# Altium project DM2080.PrjPcb (part 5 of 6)

## Sheet DM2080_USB.SchDoc: =project_title
size Tabloid; CompanyName: Luxonis Holding; DrawnBy: David Malovrh; Organization: Luxonis Holding; Address1: 1925 Harmony Park Drive; Address2: Westminster, CO; Address3: 80234; Address4: United States; DocumentNumber: D0001093; Revision: R1M1E1; SheetNumber: 9; SheetTotal: 9
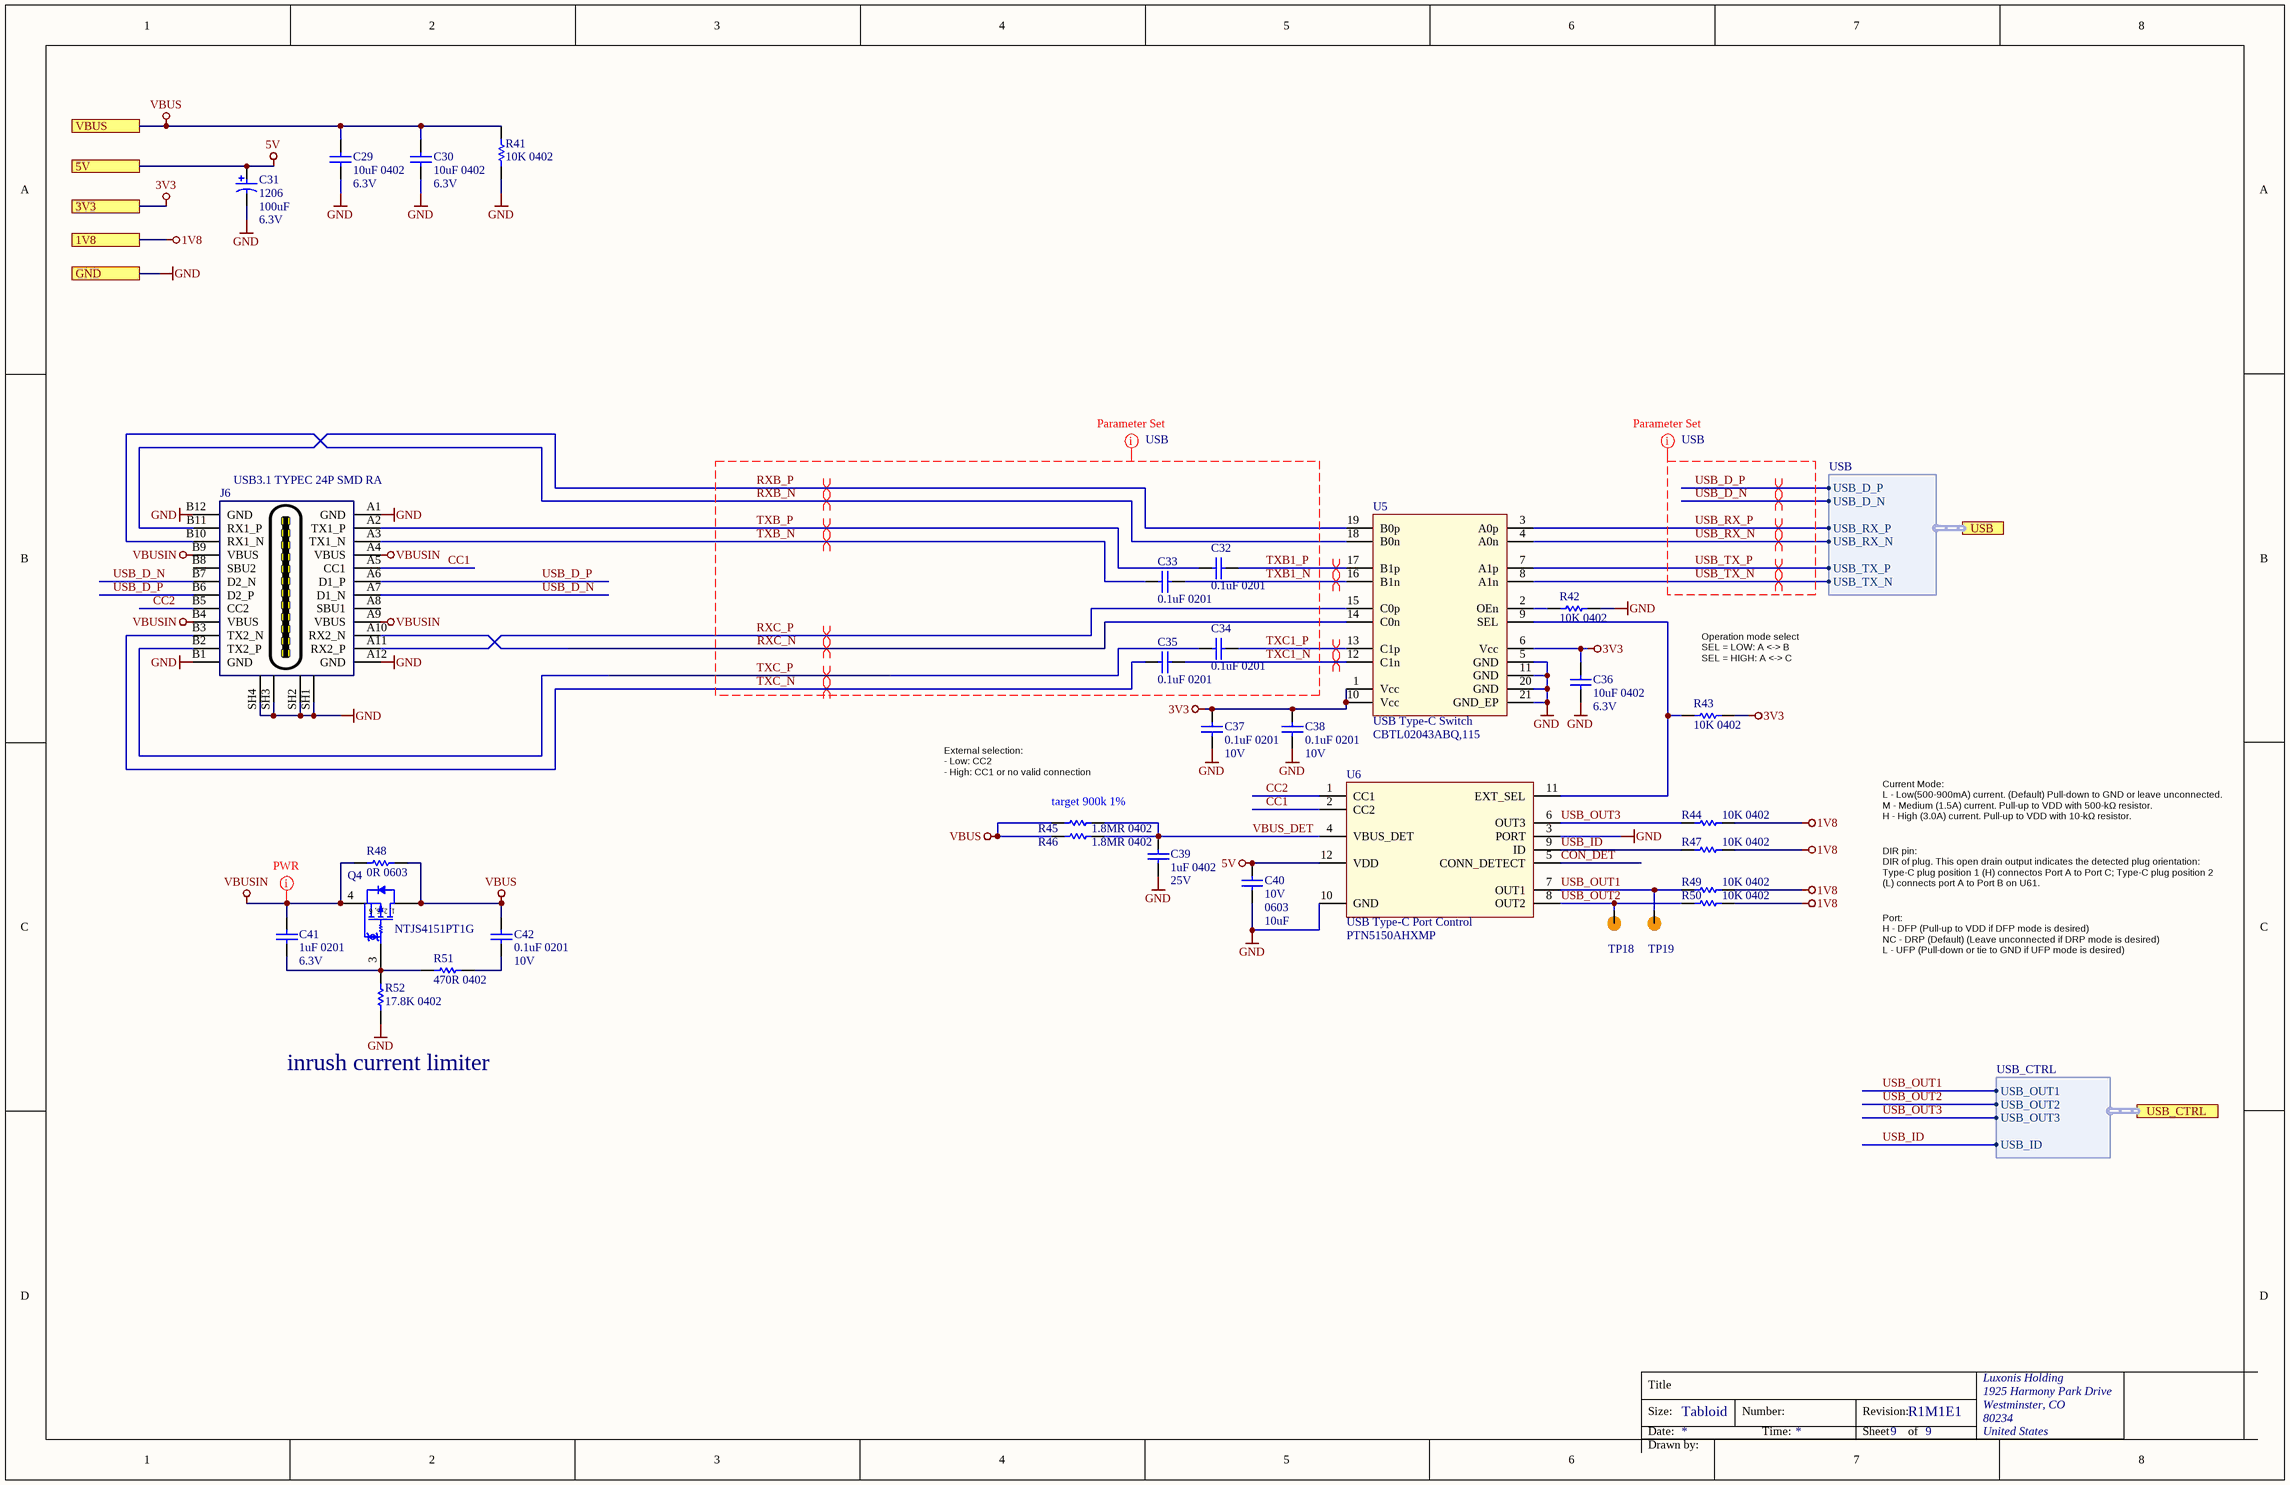
[diagram p7: DM2080_USB.SchDoc]

### Parts
C29  10uF 0402  Voltage Rating: 6.3V  [CAPC0402(1005)70_L]
C30  10uF 0402  Voltage Rating: 6.3V  [CAPC0402(1005)70_L]
C31  Size Code: 1206  Capacitance: 100uF  Rated DC Voltage (URdc): 6.3V  [RESTL1206(3216)_L]  (hidden comment: 100uF 1206 6V3 tantal)
C32  0.1uF 0201  [CAPC0201(0603)33_L]
C33  0.1uF 0201  [CAPC0201(0603)33_L]
C34  0.1uF 0201  [CAPC0201(0603)33_L]
C35  0.1uF 0201  [CAPC0201(0603)33_L]
C36  10uF 0402  Voltage Rating: 6.3V  [CAPC0402(1005)70_L]
C37  0.1uF 0201  Voltage: 10V  [CAPC0201(0603)33_L]
C38  0.1uF 0201  Voltage: 10V  [CAPC0201(0603)33_L]
C39  1uF 0402  Voltage Rating: 25V  [CAPC0402(1005)70_L]
C40  Voltage Rating: 10V  Case/Package: 0603  Capacitance: 10uF  [CAPC0603(1608)100_L]  (hidden comment: GRM188R61A106ME69D)
C41  1uF 0201  Voltage: 6.3V  [CAPC0201(0603)33_L]
C42  0.1uF 0201  Voltage: 10V  [CAPC0201(0603)33_L]
J6  USB3.1 TYPEC 24P SMD RA  [105450-0101]
Q4  NTJS4151PT1G  [ONSC-SC70-6-419B-02_W_V]
R41  10K 0402  [RESC0402(1005)_L]
R42  10K 0402  [RESC0402(1005)_L]
R43  10K 0402  [RESC0402(1005)_L]
R44  10K 0402  [RESC0402(1005)_L]
R45  1.8MR 0402  [RESC0402(1005)_L]
R46  1.8MR 0402  [RESC0402(1005)_L]
R47  10K 0402  [RESC0402(1005)_L]
R48  0R 0603  [RESC0603(1608)_N]
R49  10K 0402  [RESC0402(1005)_L]
R50  10K 0402  [RESC0402(1005)_L]
R51  470R 0402  [RESC0402(1005)_L]
R52  17.8K 0402  [RESC0402(1005)_L]
TP18  TP100_200_NS  [TP100_200_NS]  (value not drawn)  (no BOM)
TP19  TP100_200_NS  [TP100_200_NS]  (value not drawn)  (no BOM)
U5  USB Type-C Switch  Manufacturer Part Number 1: CBTL02043ABQ,115  [CBTL02043A]
U6  USB Type-C Port Control  Manufacturer Part Number 1: PTN5150AHXMP  [PTN5150H]

### Ports
1V8, 3V3, 5V, GND, USB (harness USB), USB_CTRL (harness USB_CTRL), VBUS

### Harnesses
USB: USB_D_P, USB_D_N, USB_TX_N, USB_TX_P, USB_RX_N, USB_RX_P
USB_CTRL: USB_OUT1, USB_OUT2, USB_OUT3, USB_ID

### Nets
1V8: R44.2 R47.2 R49.2 R50.2 ; port 1V8
3V3: C36.2 C37.2 C38.2 R43.2 U5.1(Vcc) U5.6(Vcc) U5.10(Vcc) ; port 3V3
5V: C31.1 C40.2 U6.12(VDD) ; port 5V
GND: C29.1 C30.1 C31.2 C36.1 C37.1 C38.1 C39.1 C40.1 J6.A1(GND) J6.A12(GND) J6.B1(GND) J6.B12(GND) J6.SH1(SH) J6.SH2(SH) J6.SH3(SH) J6.SH4(SH) R41.1 R42.2 R52.1 U5.5(GND) U5.11(GND) U5.20(GND) U5.21(GND_EP) U6.3(PORT) U6.10(GND) ; port GND
VBUS: C29.2 C30.2 C42.2 Q4.1(D) Q4.2(D) Q4.5(D) Q4.6(D) R41.2 R45.1 R46.1 R48.2 ; port VBUS
VBUSIN: C41.2 J6.A4(VBUS) J6.A9(VBUS) J6.B4(VBUS) J6.B9(VBUS) Q4.4(S) R48.1
CC1: J6.A5(CC1) U6.2(CC2)
CC2: J6.B5(CC2) U6.1(CC1)
CON_DET: U6.5(CONN_DETECT)
RXB_N: J6.B10(RX1_N) U5.18(B0n)
RXB_P: J6.B11(RX1_P) U5.19(B0p)
RXC_N: J6.A10(RX2_N) U5.14(C0n)
RXC_P: J6.A11(RX2_P) U5.15(C0p)
TXB1_N: C33.2 U5.16(B1n)
TXB1_P: C32.2 U5.17(B1p)
TXB_N: C33.1 J6.A3(TX1_N)
TXB_P: C32.1 J6.A2(TX1_P)
TXC1_N: C35.2 U5.12(C1n)
TXC1_P: C34.2 U5.13(C1p)
TXC_N: C35.1 J6.B3(TX2_N)
TXC_P: C34.1 J6.B2(TX2_P)
USB_D_N: J6.A7(D1_N) J6.B7(D2_N) ; port USB.USB_D_N
USB_D_P: J6.A6(D1_P) J6.B6(D2_P) ; port USB.USB_D_P
USB_ID: R47.1 U6.9(ID) ; port USB_CTRL.USB_ID
USB_OUT1: R49.1 TP19.1 U6.7(OUT1) ; port USB_CTRL.USB_OUT1
USB_OUT2: R50.1 TP18.1 U6.8(OUT2) ; port USB_CTRL.USB_OUT2
USB_OUT3: R44.1 U6.6(OUT3) ; port USB_CTRL.USB_OUT3
USB_RX_N: U5.4(A0n) ; port USB.USB_RX_N
USB_RX_P: U5.3(A0p) ; port USB.USB_RX_P
USB_TX_N: U5.8(A1n) ; port USB.USB_TX_N
USB_TX_P: U5.7(A1p) ; port USB.USB_TX_P
VBUS_DET: C39.2 R45.2 R46.2 U6.4(VBUS_DET)
NetC41_1: C41.1 Q4.3(G) R51.1 R52.2
NetC42_1: C42.1 R51.2
NetR42_1: R42.1 U5.2(OEn)
NetR43_1: R43.1 U5.9(SEL) U6.11(EXT_SEL)

Not connected (* = marked no-connect by the designer): J6 A8(SBU1) B8(SBU2)

### Layout directives
differential pair; differential pair class USB3: RXB_N, RXB_P, RXC_N, RXC_P, TXB1_N, TXB1_P, TXB_N, TXB_P, TXC1_N, TXC1_P, TXC_N, TXC_P, USB_D_N, USB_D_P, USB_RX_N, USB_RX_P, USB_TX_N, USB_TX_P
net class USB: RXB_N, RXB_P, RXC_N, RXC_P, TXB1_N, TXB1_P, TXB_N, TXB_P, TXC1_N, TXC1_P, TXC_N, TXC_P, USB_D_N, USB_D_P, USB_RX_N, USB_RX_P, USB_TX_N, USB_TX_P
net class Power_trace: VBUSIN

### Notes on the sheet
- (near R43) Operation mode select
  SEL = LOW: A <-> B
  SEL = HIGH: A <-> C
- External selection:
  - Low: CC2
  - High: CC1 or no valid connection
- (near R45) target 900k 1%
- Current Mode:
  L - Low(500-900mA) current. (Default) Pull-down to GND or leave unconnected.
  M - Medium (1.5A) current. Pull-up to VDD with 500-kΩ resistor.
  H - High (3.0A) current. Pull-up to VDD with 10-kΩ resistor.
- DIR pin:
  DIR of plug. This open drain output indicates the detected plug orientation: Type-C plug position 1 (H) connectos Port A to Port C; Type-C plug position 2 (L) connects port A to Port B on U61.
- Port:
  H - DFP (Pull-up to VDD if DFP mode is desired)
  NC - DRP (Default) (Leave unconnected if DRP mode is desired)
  L - UFP (Pull-down or tie to GND if UFP mode is desired)
- (near R52) inrush current limiter
- Title
- Size:
- Date:
- Tabloid
- Number:
- Time:
- Revision:
- Sheet
- of
- Drawn by:
- (in symbol NTJS4151PT1G) 1, 2, 5, 6

### Library data of the parts
C29 C30 C36 = GRM155R60J106ME15D: CAP CER 10UF 6.3V X5R 0402 20%; Manufacturer 1: Murata; Supplier 1: Digi-Key; Manufacturer Part Number 1: GRM155R60J106ME15D; Stock 1: 1839627; Pricing 1: 1=0.23000, 10=0.15700, 100=0.07950, 500=0.05442, 1000=0.04814, 2500=0.04605, 5000=0.04186 (USD); RoHS: Yes; Mount: Surface Mount; Case/Package: 0402; Case Code (Metric): 1005; Case Code (Imperial): 0402; Min Operating Temperature: -55°C; Max Operating Temperature: 85°C; Packaging: Tape and Reel; Capacitance: 10uF; Dielectric: X5R; Length: 0.039inch; Width: 0.02inch; ComponentLink1URL: https://www.murata.com/~/media/webrenewal/support/library/catalog/products/capacitor/mlcc/c02e.ashx?la=en-us&src-supplier=Digi-Key; ComponentLink1Description: https://www.murata.com/~/media/webrenewal/support/library/catalog/products/capacitor/mlcc/c02e.ashx?la=en-us&src-supplier=Digi-Key; Supplier Part Number 1: 490-13238-1-ND; Voltage Rating (DC): 6.3V; Thickness: 0.026inch; Tolerance: 20%
C31 = TLJA107M006R0500: Tantalum Capacitor, Polarized, Tantalum (dry/solid), 6.3V, 20% +Tol, 20% -Tol, 100uF, Surface Mount, 1206; Manufacturer 1: Kyocera AVX; ESR (Equivalent Series Resistance): 500mR; Leakage Current: 6uA; Ripple Current: 349mA; Supplier 1: Digi-Key; Manufacturer Part Number 1: TLJA107M006R0500; RoHS: Yes; Category: Tantalum Capacitors; Stock 1: 1699; Pricing 1: 1=0,68000, 10=0,49800, 50=0,39840, 100=0,34150, 500=0,27036, 1000=0,22768 (USD); Mount: Surface Mount; Number of Pins: 2; Dielectric Material: Tantalum; Package Shape: Rectangular; Terminal Finish: Nickel; Min Operating Temperature: -55°C; Max Operating Temperature: 125°C; JESD-609 Code: e3; Polarity: Polarized; Capacitor Type: Tantalum; Negative Tolerance: 20%; Package Style: SMTMeter; Packaging: Tape and Reel; Positive Tolerance: 20%; Termination: J BEND; Length: 3.2mm; Width: 1.6mm; Height: 1.6mm; REACH SVHC: Yes; RoHS Compliant: Yes; ComponentLink1URL: https://datasheet.ciiva.com:443/pdfs/VipMasterIC/IC/AVXC/AVXC-S-A0008508048/AVXC-S-A0008508048-1.pdf?src-supplier=IHS+Markit; ComponentLink1Description: https://datasheet.ciiva.com:443/pdfs/VipMasterIC/IC/AVXC/AVXC-S-A0008508048/AVXC-S-A0008508048-1.pdf?src-supplier=IHS+Markit; ComponentLink2URL: https://datasheet.ciiva.com/3797/21tlj-3797551.pdf?src-supplier=Arrow+Electronics; ComponentLink2Description: https://datasheet.ciiva.com/3797/21tlj-3797551.pdf?src-supplier=Arrow+Electronics; ComponentLink3URL: https://datasheet.ciiva.com/7720/1533257-7720677.pdf?src-supplier=Element14; ComponentLink3Description: https://datasheet.ciiva.com/7720/1533257-7720677.pdf?src-supplier=Element14; ComponentLink4URL: https://datasheet.ciiva.com/28609/packmark-28609461.pdf?src-supplier=Element14; ComponentLink4Description: https://datasheet.ciiva.com/28609/packmark-28609461.pdf?src-supplier=Element14; ComponentLink5URL: https://datasheet.ciiva.com/264/tlj-264694.pdf?src-supplier=Digi-Key; ComponentLink5Description: https://datasheet.ciiva.com/264/tlj-264694.pdf?src-supplier=Digi-Key; ComponentLink6URL: https://datasheet.ciiva.com/264/tlj-264695.pdf?src-supplier=Digi-Key; ComponentLink6Description: https://datasheet.ciiva.com/264/tlj-264695.pdf?src-supplier=Digi-Key; ComponentLink7URL: https://datasheet.ciiva.com/264/tlj-264696.pdf?src-supplier=Digi-Key; ComponentLink7Description: https://datasheet.ciiva.com/264/tlj-264696.pdf?src-supplier=Digi-Key; ComponentLink8URL: https://datasheet.ciiva.com/11229/tlj-11229385.pdf?src-supplier=Avnet; ComponentLink8Description: https://datasheet.ciiva.com/11229/tlj-11229385.pdf?src-supplier=Avnet; ComponentLink9URL: https://datasheet.ciiva.com/28609/1910903-28609449.pdf?src-supplier=Element14; ComponentLink9Description: https://datasheet.ciiva.com/28609/1910903-28609449.pdf?src-supplier=Element14; ComponentLink10URL: https://datasheet.ciiva.com/16501/tlj-16501341.pdf?src-supplier=Future+Electronics; ComponentLink10Description: https://datasheet.ciiva.com/16501/tlj-16501341.pdf?src-supplier=Future+Electronics; ComponentLink11URL: https://datasheet.ciiva.com/14590/70001364-14590207.pdf?src-supplier=Allied+Electronics; ComponentLink11Description: https://datasheet.ciiva.com/14590/70001364-14590207.pdf?src-supplier=Allied+Electronics; Supplier Part Number 1: 478-3345-1-ND
C32-C35 C37 C38 C42 = GRM033R61A104KE15D: CAP CER 0.1UF 10V X5R 0201; Manufacturer 1: Murata; Capacitance: 100nF; Tolerance: 10%; Supplier 1: Digi-Key; Manufacturer Part Number 1: GRM033R61A104KE15D; Stock 1: 45335312; Pricing 1: 1=0.10000, 10=0.04200, 100=0.01860, 500=0.01330, 1000=0.01045, 2500=0.00950, 5000=0.00874 (USD); RoHS: Yes; Mount: Surface Mount; Case/Package: 0201; Weight: 6E-06oz; Case Code (Metric): 0603; Case Code (Imperial): 0201; Min Operating Temperature: -55°C; Max Operating Temperature: 85°C; Packaging: Tape and Reel; Voltage Rating: 10V; Package Quantity: 1; Voltage Rating (DC): 10V; Dielectric: X5R; Termination: SMD/SMT; Length: 0.6mm; Height: 0.3mm; Width: 0.012inch; Thickness: 0.013inch; Depth: 0.3mm; Radiation Hardening: No; Lead Free: Lead Free; REACH SVHC: No SVHC; ComponentLink1URL: https://datasheet.ciiva.com/26843/getdatasheetpartid-308656-26843739.pdf?src-supplier=Verical; ComponentLink1Description: https://datasheet.ciiva.com/26843/getdatasheetpartid-308656-26843739.pdf?src-supplier=Verical; ComponentLink2URL: https://datasheet.ciiva.com/5413/product-5413117.pdf?src-supplier=Mouser; ComponentLink2Description: https://datasheet.ciiva.com/5413/product-5413117.pdf?src-supplier=Mouser; ComponentLink3URL: https://datasheet.ciiva.com/6256/partnumbering-e-01-6256406.pdf?src-supplier=Digi-Key; ComponentLink3Description: https://datasheet.ciiva.com/6256/partnumbering-e-01-6256406.pdf?src-supplier=Digi-Key; ComponentLink4URL: https://datasheet.ciiva.com/6256/partnumbering-e-01-6256407.pdf?src-supplier=Digi-Key; ComponentLink4Description: https://datasheet.ciiva.com/6256/partnumbering-e-01-6256407.pdf?src-supplier=Digi-Key; ComponentLink5URL: https://datasheet.ciiva.com/6256/partnumbering-e-01-6256408.pdf?src-supplier=Digi-Key; ComponentLink5Description: https://datasheet.ciiva.com/6256/partnumbering-e-01-6256408.pdf?src-supplier=Digi-Key; Supplier Part Number 1: 490-5881-1-ND
  C32-C35: Voltage: 10V
C39 = GRM155R61E105KA12D: CAP CER 1UF 25V X5R 0402 10%; Manufacturer 1: Murata; Material: Ceramic; Supplier 1: Digi-Key; Manufacturer Part Number 1: GRM155R61E105KA12D; Stock 1: 200653; Pricing 1: 1=0.10000, 10=0.07100, 100=0.03350, 500=0.02352, 1000=0.01947, 2500=0.01812, 5000=0.01658 (USD); RoHS: Yes; Mount: Surface Mount; Case/Package: 0402; Weight: 0.000212oz; Case Code (Metric): 1005; Case Code (Imperial): 0402; Min Operating Temperature: -55°C; Max Operating Temperature: 85°C; Tolerance: 10%; Capacitance: 1uF; Dielectric: X5R; Voltage Rating (DC): 25V; Packaging: Tape and Reel; Package Quantity: 10000; Termination: SMD/SMT; Voltage: 25V; Length: 1mm; Height: 0.5mm; Width: 0.5mm; Thickness: 0.022inch; Depth: 0.5mm; Lead Free: Lead Free; REACH SVHC: No SVHC; ComponentLink1URL: https://datasheet.ciiva.com/22732/1666664-22732122.pdf?src-supplier=Element14; ComponentLink1Description: https://datasheet.ciiva.com/22732/1666664-22732122.pdf?src-supplier=Element14; ComponentLink2URL: https://datasheet.ciiva.com/7719/1666664-7719006.pdf?src-supplier=Element14; ComponentLink2Description: https://datasheet.ciiva.com/7719/1666664-7719006.pdf?src-supplier=Element14; Supplier Part Number 1: 490-10017-1-ND; Supplier 2: Arrow; Supplier 3: TTI; Supplier Part Number 2: GRM155R61E105KA12D; Supplier Part Number 3: GRM155R61E105KA12D
C40 = CMP-004-000018-1: CAP CER 10UF 10V X5R 0603 20%; Manufacturer 1: Murata; Material: Ceramic; Packaging: Tape and Reel; ComponentLink6Description: http://www.farnell.com/datasheets/1872210.pdf?src-supplier=Newark; ComponentLink1URL: http://www.mouser.com/ds/2/281/c02e-2905.pdf?src-supplier=Mouser; ComponentLink5Description: http://search.murata.co.jp/Ceramy/image/img/A01X/G101/ENG/GRM188R61A106ME69-01.pdf?src-supplier=Digi-Key; Stock 1: 2873098; ComponentLink8Description: http://www.farnell.com/datasheets/2048014.pdf?src-supplier=Newark; Depth: 0.8mm; Termination: SMD/SMT; Weight: 0.000222oz; Mount: Surface Mount; Manufacturer Part Number 1: GRM188R61A106ME69D; ComponentLink4URL: http://www.farnell.com/datasheets/1872210.pdf?src-supplier=Farnell; ComponentLink1Description: http://www.mouser.com/ds/2/281/c02e-2905.pdf?src-supplier=Mouser; Voltage Rating (DC): 10V; ComponentLink7URL: http://www.farnell.com/datasheets/2048014.pdf?src-supplier=Element14; ComponentLink8URL: http://www.farnell.com/datasheets/2048014.pdf?src-supplier=Newark; Tolerance: 20%; REACH SVHC: Unknown; ComponentLink5URL: http://search.murata.co.jp/Ceramy/image/img/A01X/G101/ENG/GRM188R61A106ME69-01.pdf?src-supplier=Digi-Key; Length: 1.6mm; Case Code (Imperial): 0603; Min Operating Temperature: -55°C; Max Operating Temperature: 85°C; Dielectric: X5R; Case Code (Metric): 1608; ComponentLink3Description: http://www.farnell.com/datasheets/2048014.pdf?src-supplier=Farnell; Width: 0.8mm; ComponentLink2URL: http://components.arrow.com/part/dataview/0323_06119472?src-supplier=Arrow+Europe; ComponentLink7Description: http://www.farnell.com/datasheets/2048014.pdf?src-supplier=Element14; Height: 0.8mm; Lead Free: Lead Free; Design Item ID: GRM188R61A106ME69D; ComponentLink2Description: http://components.arrow.com/part/dataview/0323_06119472?src-supplier=Arrow+Europe; ComponentLink6URL: http://www.farnell.com/datasheets/1872210.pdf?src-supplier=Newark; ComponentLink3URL: http://www.farnell.com/datasheets/2048014.pdf?src-supplier=Farnell; Thickness: 0.035inch; ComponentLink4Description: http://www.farnell.com/datasheets/1872210.pdf?src-supplier=Farnell; Pricing 1: 1=0.21000, 10=0.14100, 100=0.07130, 500=0.04876, 1000=0.04313 (USD); Package Quantity: 4000; Source: LuxonisMaster.SchLib; RoHS: Yes
C41 = GRM033R60J105MEA2D: CAP CER 1UF 6.3V X5R 0201 20%; Manufacturer 1: Murata; Supplier 1: Digi-Key; Manufacturer Part Number 1: GRM033R60J105MEA2D; Stock 1: 26228841; Pricing 1: 1=0.12000, 10=0.08500, 100=0.04000, 500=0.02806, 1000=0.02323, 2500=0.02162, 5000=0.01978 (USD); RoHS: Yes; Mount: Surface Mount; Case/Package: 0201; Weight: 1.2E-05oz; Case Code (Imperial): 0201; Case Code (Metric): 0603; Min Operating Temperature: -55°C; Max Operating Temperature: 85°C; Packaging: Cut Tape; Capacitance: 1uF; Tolerance: 20%; Voltage Rating: 6.3V; Voltage Rating (DC): 6.3V; Dielectric: X5R; Package Quantity: 1; Termination: SMD/SMT; Length: 0.6mm; Height: 0.3mm; Width: 0.3mm; Thickness: 300um; Depth: 0.3mm; REACH SVHC: No SVHC; Lead Free: Lead Free; ComponentLink1URL: https://datasheet.ciiva.com/18699/grm033r60j105mea2-02-18699520.pdf?src-supplier=Digi-Key; ComponentLink1Description: https://datasheet.ciiva.com/18699/grm033r60j105mea2-02-18699520.pdf?src-supplier=Digi-Key; ComponentLink2URL: https://datasheet.ciiva.com/24218/c02e-24218376.pdf?src-supplier=Mouser; ComponentLink2Description: https://datasheet.ciiva.com/24218/c02e-24218376.pdf?src-supplier=Mouser; ComponentLink3URL: https://datasheet.ciiva.com/18699/partnumbering-e-01-18699519.pdf?src-supplier=Digi-Key; ComponentLink3Description: https://datasheet.ciiva.com/18699/partnumbering-e-01-18699519.pdf?src-supplier=Digi-Key; Supplier Part Number 1: 490-7229-1-ND
J6 = 105450-0101: CONN RCP USB3.1 TYPEC 24P SMD RA; Manufacturer 1: Molex; Connector Type: USB; Number of Contacts: 24; Gender: Receptacle; Number of Ports: 1; Current Rating: 5A; Mating Cycles: 10000; Shielding: Shielded; Pitch: 0.5mm; Supplier 1: Digi-Key; Manufacturer Part Number 1: 105450-0101; Stock 1: 13882; Pricing 1: 1=2.15000, 10=1.94900, 25=1.82960, 50=1.75000, 100=1.67050, 250=1.51140, 500=1.39208 (USD); RoHS: Yes; Mount: Surface Mount,Through Hole,Horizontal; Case/Package: 0101; Number of Pins: 24; Contact Material: Copper Alloy; Contact Plating: Gold; Number of Terminals: 24; Housing Material: Thermoplastic; Insulation Color: Black; Min Operating Temperature: -30°C; Max Operating Temperature: 85°C; Packaging: Tape and Reel; Orientation: Right Angle; Termination: Solder; USB Standard: USB 3.1; Features: Shielded; Length: 8.94mm; REACH SVHC: Unknown; Flammability Rating: UL94 V-0; ComponentLink1URL: http://www.farnell.com/datasheets/2673427.pdf?src-supplier=Farnell; ComponentLink1Description: http://www.farnell.com/datasheets/2673427.pdf?src-supplier=Farnell; ComponentLink2URL: http://www.farnell.com/datasheets/2801634.pdf?src-supplier=Farnell; ComponentLink2Description: http://www.farnell.com/datasheets/2801634.pdf?src-supplier=Farnell; ComponentLink3URL: http://www.farnell.com/datasheets/2672741.pdf?src-supplier=Newark; ComponentLink3Description: http://www.farnell.com/datasheets/2672741.pdf?src-supplier=Newark; ComponentLink4URL: https://www.molex.com/pdm_docs/sd/1054500101_sd.pdf?src-supplier=Digi-Key; ComponentLink4Description: https://www.molex.com/pdm_docs/sd/1054500101_sd.pdf?src-supplier=Digi-Key; ComponentLink5URL: https://www.molex.com/pdm_docs/ps/PS-105448-001.pdf?src-supplier=Digi-Key; ComponentLink5Description: https://www.molex.com/pdm_docs/ps/PS-105448-001.pdf?src-supplier=Digi-Key; ComponentLink6URL: http://www.farnell.com/datasheets/2015275.pdf?src-supplier=Element14; ComponentLink6Description: http://www.farnell.com/datasheets/2015275.pdf?src-supplier=Element14; ComponentLink7URL: http://www.literature.molex.com/SQLImages/kelmscott/Molex/PDF_Images/987651-4081.PDF?src-supplier=Avnet; ComponentLink7Description: http://www.literature.molex.com/SQLImages/kelmscott/Molex/PDF_Images/987651-4081.PDF?src-supplier=Avnet; ComponentLink8URL: http://www.literature.molex.com/SQLImages/kelmscott/Molex/PDF_Images/987651-4081.PDF?src-supplier=Avnet+Asia; ComponentLink8Description: http://www.literature.molex.com/SQLImages/kelmscott/Molex/PDF_Images/987651-4081.PDF?src-supplier=Avnet+Asia; Supplier Part Number 1: WM12856CT-ND; Supplier 2: Newark; Supplier 3: Mouser; Supplier Part Number 2: 02AH5567; Supplier Part Number 3: 538-105450-0101
Q4 = NTJS4151PT1G: Trench Power MOSFET, -20 V, -4.2 A, Single P-Channel, 6-Pin SC70, Pb-Free, Tape and Reel; Manufacturer 1: ON Semiconductor; VGS(th) Max (V): 1.2; VGS Max (V): 12; Crss Typ (pF): 110; Ciss Typ (pF): 850; PD Max (W): 1; Qrr Typ (nC): 0.23; ID Max (A): 4.2; Coss Typ (pF): 160; Channel Polarity: P Channel; V(BR)DSS Min (V): 20; Mounting Technology: Surface Mount; ComponentLink3Description: Package Specification; Packing: Tape and Reel; DatasheetVersion: Rev. 1; RoHS: Pb-Free; Configuration: Single; PackageReference: SC70-6-419B-02_W; PackageVersion: Rev. W; Package Type: SC-88-6 / SC-70-6 / SOT-363-6; ComponentLink3URL: http://www.onsemi.com/pub_link/Collateral/SMF05C-D.PDF; PackageDescription: 6-Pin Small Outline Transistor, Body 2 x 1.25 mm, Pitch 0.65 mm; PartNumber: NTJS4151PT1G; ComponentLink2Description: Datasheet; ComponentLink1Description: Manufacturer URL; ComponentLink2URL: http://www.onsemi.com/pub_link/Collateral/NTJS4151P-D.PDF; ComponentLink1URL: http://www.onsemi.com/; Manufacturer Part Number 1: NTJS4151PT1G
R41-R44 R47 R49 R50 = RC0402FR-1310KL: as R8 on sheet DM2080_Connector_B; ComponentLink1URL: https://datasheet.ciiva.com/16940/pyu-rc0402-51-rohs-l-6-16940293.pdf?src-supplier=Avnet+Europe; ComponentLink1Description: https://datasheet.ciiva.com/16940/pyu-rc0402-51-rohs-l-6-16940293.pdf?src-supplier=Avnet+Europe; ComponentLink2URL: https://datasheet.ciiva.com/28386/pyu-rc0402-51-rohs-l-6-28386855.pdf?src-supplier=Avnet+Europe; ComponentLink2Description: https://datasheet.ciiva.com/28386/pyu-rc0402-51-rohs-l-6-28386855.pdf?src-supplier=Avnet+Europe; ComponentLink3URL: https://datasheet.ciiva.com/16740/pyu-rc0402-51-rohs-l-6-r-16740602.pdf?src-supplier=Future+Electronics; ComponentLink3Description: https://datasheet.ciiva.com/16740/pyu-rc0402-51-rohs-l-6-r-16740602.pdf?src-supplier=Future+Electronics; ComponentLink4URL: https://datasheet.ciiva.com/8891/pyu-rc0402-51-rohs-l-6-8891339.pdf?src-supplier=Avnet; ComponentLink4Description: https://datasheet.ciiva.com/8891/pyu-rc0402-51-rohs-l-6-8891339.pdf?src-supplier=Avnet; ComponentLink5URL: https://datasheet.ciiva.com/5557/pyu-rc0402-51-rohs-l-6-r-5557997.pdf?src-supplier=Mouser; ComponentLink5Description: https://datasheet.ciiva.com/5557/pyu-rc0402-51-rohs-l-6-r-5557997.pdf?src-supplier=Mouser; ComponentLink6URL: https://datasheet.ciiva.com/7983/1018594-7983533.pdf?src-supplier=Element14; ComponentLink6Description: https://datasheet.ciiva.com/7983/1018594-7983533.pdf?src-supplier=Element14; Supplier 1: Newark; Manufacturer Part Number 1: RC0402FR-1310KL; Stock 1: 62239; Pricing 1: 1=0.10000, 25=0.01200, 100=0.00400, 250=0.00400, 500=0.00300, 1000=0.00300 (USD); RoHS: Yes; Case/Package: 0402; Number of Pins: 2; Contact Plating: Tin,Matte,Lead; Case Code (Imperial): 0402; Case Code (Metric): 1005; Min Operating Temperature: -55°C; Max Operating Temperature: 155°C; Tolerance: 1%; Composition: Thick Film; Packaging: Tape and Reel; Termination: SMD/SMT; Military Standard: Not; Voltage Rating (DC): 50V; Working Voltage: 50V; Number of Terminations: 2; Length: 1mm; Depth: 0.5mm; Radiation Hardening: No; REACH SVHC: No SVHC; Lead Free: Lead Free; Supplier Part Number 1: 67R9960
R45 R46 = CRCW04021M80FKED: RES SMD 1.8M OHM 1% 1/16W 0402; Manufacturer 1: Vishay; Voltage Rating: 50V; Temperature Coefficient: 100ppm/°C; Power Rating: 63mW; Supplier 1: Digi-Key; Manufacturer Part Number 1: CRCW04021M80FKED; Stock 1: 26061; Pricing 1: 1=0.10000, 10=0.03800, 100=0.01540, 1000=0.00690, 2500=0.00599, 5000=0.00495 (USD); RoHS: Yes; Mount: Surface Mount; Case/Package: 0402; Number of Pins: 2; Weight: 2.3E-05oz; Case Code (Imperial): 0402; Case Code (Metric): 1005; Contact Plating: Tin; Min Operating Temperature: -55°C; Max Operating Temperature: 155°C; Packaging: Tape and Reel; Package Quantity: 10000; Termination: SMD/SMT; Voltage Rating (DC): 50V; Composition: Thick Film; Tolerance: 1%; Military Standard: Not; Resistance: 1.8MR; Length: 1mm; Height: 0.35mm; Width: 0.5mm; Depth: 0.5mm; Radiation Hardening: No; Lead Free: Lead Free; REACH SVHC: Unknown; ComponentLink1URL: https://datasheet.ciiva.com/11812/0900766b80d98824-11812579.pdf?src-supplier=RSComponents; ComponentLink1Description: https://datasheet.ciiva.com/11812/0900766b80d98824-11812579.pdf?src-supplier=RSComponents; ComponentLink2URL: https://datasheet.ciiva.com/16886/dcrcwe3-16886536.pdf?src-supplier=Avnet+Europe; ComponentLink2Description: https://datasheet.ciiva.com/16886/dcrcwe3-16886536.pdf?src-supplier=Avnet+Europe; ComponentLink3URL: https://datasheet.ciiva.com/7800/1697337-7800987.pdf?src-supplier=Element14; ComponentLink3Description: https://datasheet.ciiva.com/7800/1697337-7800987.pdf?src-supplier=Element14; ComponentLink4URL: https://datasheet.ciiva.com/16786/70201119-16786875.pdf?src-supplier=Allied+Electronics; ComponentLink4Description: https://datasheet.ciiva.com/16786/70201119-16786875.pdf?src-supplier=Allied+Electronics; ComponentLink5URL: https://datasheet.ciiva.com/22676/1700796-22676027.pdf?src-supplier=Element14; ComponentLink5Description: https://datasheet.ciiva.com/22676/1700796-22676027.pdf?src-supplier=Element14; ComponentLink6URL: https://datasheet.ciiva.com/7800/1697337-7800988.pdf?src-supplier=Element14; ComponentLink6Description: https://datasheet.ciiva.com/7800/1697337-7800988.pdf?src-supplier=Element14; ComponentLink7URL: https://datasheet.ciiva.com/26316/fld-crcw-e3-data-en-26316605.pdf?src-supplier=Distrelec; ComponentLink7Description: https://datasheet.ciiva.com/26316/fld-crcw-e3-data-en-26316605.pdf?src-supplier=Distrelec; ComponentLink8URL: https://datasheet.ciiva.com/8336/dcrcwe3-8336646.pdf?src-supplier=Avnet; ComponentLink8Description: https://datasheet.ciiva.com/8336/dcrcwe3-8336646.pdf?src-supplier=Avnet; Supplier Part Number 1: 541-1.80MLCT-ND
R48 = CRCW06030000Z0EA: RES SMD 0 OHM JUMPER 1/10W 0603 0 Ohms Jumper 0.1W, 1/10W Chip Resistor 0603 (1608 Metric) Automotive AEC-Q200 Thick Film; Manufacturer 1: Vishay; Manufacturer Part Number 1: CRCW0603-0000Z0EA; Resistance: 0mR; Power Rating: 100mW; Voltage Rating: 75V; Temperature Coefficient: 100ppm/°C; Tolerance: 5%; Current Rating: 2A; Supplier 1: Digi-Key; Stock 1: 742743; Pricing 1: 1=0.100000, 10=0.034000, 25=0.024400, 50=0.018600, 100=0.013800, 250=0.010480, 500=0.008400, 1000=0.006180 (USD); RoHS: Yes; Mount: Surface Mount; Case/Package: 0603; Weight: 7.1E-05oz; Contact Plating: Tin,Lead; Case Code (Metric): 1608; Case Code (Imperial): 0603; Min Operating Temperature: -55°C; Max Operating Temperature: 155°C; Composition: Thick Film; Termination: SMD/SMT; Packaging: Tape and Reel; Package Quantity: 1; Number of Terminations: 2; Military Standard: Not; Max Power Dissipation: 100mW; Voltage Rating (DC): 75V; Features: Automotive AEC-Q200; Working Voltage: 75V; Length: 1.55mm; Height: 0.02inch; Width: 0.033inch; Depth: 0.85mm; Radiation Hardening: No; Lead Free: Lead Free; REACH SVHC: Unknown; ComponentLink1URL: https://datasheet.ciiva.com/2461/dcrcwe3-2461968.pdf?src-supplier=Digi-Key; ComponentLink1Description: https://datasheet.ciiva.com/2461/dcrcwe3-2461968.pdf?src-supplier=Digi-Key; ComponentLink2URL: https://datasheet.ciiva.com/2461/dcrcwe3-2461969.pdf?src-supplier=Digi-Key; ComponentLink2Description: https://datasheet.ciiva.com/2461/dcrcwe3-2461969.pdf?src-supplier=Digi-Key; ComponentLink3URL: https://datasheet.ciiva.com/2461/dcrcwe3-2461970.pdf?src-supplier=Digi-Key; ComponentLink3Description: https://datasheet.ciiva.com/2461/dcrcwe3-2461970.pdf?src-supplier=Digi-Key; ComponentLink4URL: https://datasheet.ciiva.com/8340/dcrcwe3-8340197.pdf?src-supplier=Avnet; ComponentLink4Description: https://datasheet.ciiva.com/8340/dcrcwe3-8340197.pdf?src-supplier=Avnet; ComponentLink5URL: https://datasheet.ciiva.com/16941/dcrcw-16941302.pdf?src-supplier=Avnet+Europe; ComponentLink5Description: https://datasheet.ciiva.com/16941/dcrcw-16941302.pdf?src-supplier=Avnet+Europe; ComponentLink6URL: https://datasheet.ciiva.com/16199/dcrcwe3-16199063.pdf?src-supplier=Future+Electronics; ComponentLink6Description: https://datasheet.ciiva.com/16199/dcrcwe3-16199063.pdf?src-supplier=Future+Electronics; ComponentLink7URL: https://datasheet.ciiva.com/16725/70201119-16725175.pdf?src-supplier=Allied+Electronics; ComponentLink7Description: https://datasheet.ciiva.com/16725/70201119-16725175.pdf?src-supplier=Allied+Electronics; ComponentLink8URL: https://datasheet.ciiva.com/26316/fld-crcw-e3-data-en-26316615.pdf?src-supplier=Distrelec; ComponentLink8Description: https://datasheet.ciiva.com/26316/fld-crcw-e3-data-en-26316615.pdf?src-supplier=Distrelec; ComponentLink9URL: https://datasheet.ciiva.com/5544/dcrcwe3-109170-5544344.pdf?src-supplier=Mouser; ComponentLink9Description: https://datasheet.ciiva.com/5544/dcrcwe3-109170-5544344.pdf?src-supplier=Mouser; ComponentLink10URL: https://datasheet.ciiva.com/7841/1720486-7841816.pdf?src-supplier=Element14; ComponentLink10Description: https://datasheet.ciiva.com/7841/1720486-7841816.pdf?src-supplier=Element14; ComponentLink11URL: https://datasheet.ciiva.com/7841/1720486-7841817.pdf?src-supplier=Element14; ComponentLink11Description: https://datasheet.ciiva.com/7841/1720486-7841817.pdf?src-supplier=Element14; ComponentLink12URL: https://datasheet.ciiva.com/7841/125364-7841818.pdf?src-supplier=Element14; ComponentLink12Description: https://datasheet.ciiva.com/7841/125364-7841818.pdf?src-supplier=Element14; ComponentLink13URL: https://datasheet.ciiva.com/16721/70201119-16721450.pdf?src-supplier=Allied+Electronics; ComponentLink13Description: https://datasheet.ciiva.com/16721/70201119-16721450.pdf?src-supplier=Allied+Electronics; Supplier Part Number 1: 541-0.0GCT-ND
R51 = CRCW0402470RFKED: RES SMD 470 OHM 1% 1/16W 0402; Manufacturer 1: Vishay; Temperature Coefficient: 100ppm/°C; Power Rating: 63mW; Voltage Rating: 50V; Supplier 1: Digi-Key; Manufacturer Part Number 1: CRCW0402470RFKED; Stock 1: 9199; Pricing 1: 1=0.10000, 10=0.03800, 100=0.01540, 1000=0.00690, 2500=0.00599, 5000=0.00495 (USD); RoHS: Yes; Mount: Surface Mount; Case/Package: 0402; Weight: 2.3E-05oz; Case Code (Imperial): 0402; Case Code (Metric): 1005; Contact Plating: Tin; Min Operating Temperature: -55°C; Max Operating Temperature: 155°C; Resistance: 470R; Tolerance: 1%; Composition: Thick Film; Packaging: Tape and Reel; Voltage Rating (DC): 50V; Termination: SMD/SMT; Number of Terminations: 2; Package Quantity: 10; Military Standard: Not; Max Power Dissipation: 63mW; Features: Automotive AEC-Q200; Length: 1mm; Height: 0.35mm; Width: 0.5mm; Depth: 0.5mm; Radiation Hardening: No; REACH SVHC: Unknown; Lead Free: Lead Free; ComponentLink1URL: https://datasheet.ciiva.com/11811/0900766b80d98824-11811416.pdf?src-supplier=RSComponents; ComponentLink1Description: https://datasheet.ciiva.com/11811/0900766b80d98824-11811416.pdf?src-supplier=RSComponents; ComponentLink2URL: https://datasheet.ciiva.com/16764/70201119-16764886.pdf?src-supplier=Allied+Electronics; ComponentLink2Description: https://datasheet.ciiva.com/16764/70201119-16764886.pdf?src-supplier=Allied+Electronics; ComponentLink3URL: https://datasheet.ciiva.com/28613/1720486-28613479.pdf?src-supplier=Element14; ComponentLink3Description: https://datasheet.ciiva.com/28613/1720486-28613479.pdf?src-supplier=Element14; ComponentLink4URL: https://datasheet.ciiva.com/3256/dcrcwe3-3256553.pdf?src-supplier=Avnet; ComponentLink4Description: https://datasheet.ciiva.com/3256/dcrcwe3-3256553.pdf?src-supplier=Avnet; ComponentLink5URL: https://datasheet.ciiva.com/7777/1720486-7777243.pdf?src-supplier=Element14; ComponentLink5Description: https://datasheet.ciiva.com/7777/1720486-7777243.pdf?src-supplier=Element14; ComponentLink6URL: https://datasheet.ciiva.com/8336/dcrcwe3-8336715.pdf?src-supplier=Avnet; ComponentLink6Description: https://datasheet.ciiva.com/8336/dcrcwe3-8336715.pdf?src-supplier=Avnet; ComponentLink7URL: https://datasheet.ciiva.com/7777/1697337-7777244.pdf?src-supplier=Element14; ComponentLink7Description: https://datasheet.ciiva.com/7777/1697337-7777244.pdf?src-supplier=Element14; ComponentLink8URL: https://datasheet.ciiva.com/2463/dcrcwe3-2463085.pdf?src-supplier=Digi-Key; ComponentLink8Description: https://datasheet.ciiva.com/2463/dcrcwe3-2463085.pdf?src-supplier=Digi-Key; ComponentLink9URL: https://datasheet.ciiva.com/16362/dcrcwe3-16362109.pdf?src-supplier=Future+Electronics; ComponentLink9Description: https://datasheet.ciiva.com/16362/dcrcwe3-16362109.pdf?src-supplier=Future+Electronics; ComponentLink10URL: https://datasheet.ciiva.com/16882/dcrcwe3-16882493.pdf?src-supplier=Avnet+Europe; ComponentLink10Description: https://datasheet.ciiva.com/16882/dcrcwe3-16882493.pdf?src-supplier=Avnet+Europe; ComponentLink11URL: https://datasheet.ciiva.com/2463/dcrcwe3-2463086.pdf?src-supplier=Digi-Key; ComponentLink11Description: https://datasheet.ciiva.com/2463/dcrcwe3-2463086.pdf?src-supplier=Digi-Key; ComponentLink12URL: https://datasheet.ciiva.com/2463/dcrcwe3-2463087.pdf?src-supplier=Digi-Key; ComponentLink12Description: https://datasheet.ciiva.com/2463/dcrcwe3-2463087.pdf?src-supplier=Digi-Key; Supplier 2: Newark; Supplier Part Number 1: 541-470LCT-ND; Supplier Part Number 2: 26W9133
R52 = ERJ-2RKF1782X: RES SMD 17.8K OHM 1% 1/10W 0402 17.8 kOhms ±1% 0.1W, 1/10W Chip Resistor 0402 (1005 Metric) Automotive AEC-Q200 Thick Film; Manufacturer 1: Panasonic; Temperature Coefficient: 100ppm/°C; Power Rating: 100mW; Voltage Rating: 50V; Resistance: 17.8kR; RoHS: Yes; Mount: Surface Mount; Case Code (Metric): 1005; Case Code (Imperial): 0402; Contact Plating: Tin; Min Operating Temperature: -55°C; Max Operating Temperature: 155°C; Packaging: Tape and Reel; Composition: Thick Film; Termination: SMD/SMT; Package Quantity: 1; Voltage Rating (DC): 50V; Military Standard: Not; Number of Terminations: 2; Max Power Dissipation: 100mW; Features: Automotive AEC-Q200; Length: 1mm; Height: 0.35mm; Width: 0.02inch; Depth: 0.5mm; Lead Free: Lead Free; REACH SVHC: Unknown; ComponentLink1URL: https://datasheet.ciiva.com/24027/aoa0000ce2-24027013.pdf?src-supplier=Mouser; ComponentLink1Description: https://datasheet.ciiva.com/24027/aoa0000ce2-24027013.pdf?src-supplier=Mouser; ComponentLink2URL: https://datasheet.ciiva.com/46372/1678782-46372997.pdf?src-supplier=Element14; ComponentLink2Description: https://datasheet.ciiva.com/46372/1678782-46372997.pdf?src-supplier=Element14; ComponentLink3URL: https://datasheet.ciiva.com/28594/1694929-28594534.pdf?src-supplier=Element14; ComponentLink3Description: https://datasheet.ciiva.com/28594/1694929-28594534.pdf?src-supplier=Element14; ComponentLink4URL: https://datasheet.ciiva.com/46372/1678782-46372998.pdf?src-supplier=Element14; ComponentLink4Description: https://datasheet.ciiva.com/46372/1678782-46372998.pdf?src-supplier=Element14; ComponentLink5URL: https://datasheet.ciiva.com/22764/1678782-22764807.pdf?src-supplier=Farnell; ComponentLink5Description: https://datasheet.ciiva.com/22764/1678782-22764807.pdf?src-supplier=Farnell; ComponentLink6URL: https://datasheet.ciiva.com/16769/70260748-16769816.pdf?src-supplier=Allied+Electronics; ComponentLink6Description: https://datasheet.ciiva.com/16769/70260748-16769816.pdf?src-supplier=Allied+Electronics; ComponentLink7URL: https://datasheet.ciiva.com/30116/aoa0000ce2-30116554.pdf?src-supplier=Onlinecomponents.com; ComponentLink7Description: https://datasheet.ciiva.com/30116/aoa0000ce2-30116554.pdf?src-supplier=Onlinecomponents.com; ComponentLink8URL: https://datasheet.ciiva.com/16775/70260748-16775211.pdf?src-supplier=Allied+Electronics; ComponentLink8Description: https://datasheet.ciiva.com/16775/70260748-16775211.pdf?src-supplier=Allied+Electronics; ComponentLink9URL: https://datasheet.ciiva.com/43467/1678782-43467419.pdf?src-supplier=Farnell; ComponentLink9Description: https://datasheet.ciiva.com/43467/1678782-43467419.pdf?src-supplier=Farnell; ComponentLink10URL: https://datasheet.ciiva.com/22668/1678782-22668623.pdf?src-supplier=Element14; ComponentLink10Description: https://datasheet.ciiva.com/22668/1678782-22668623.pdf?src-supplier=Element14; Supplier 1: Digi-Key; Manufacturer Part Number 1: ERJ-2RKF1782X; Stock 1: 250542; Pricing 1: 1=0.10000, 10=0.04500, 100=0.01830, 1000=0.00823, 2500=0.00715, 5000=0.00590 (USD); Case/Package: 0402; Tolerance: 1%; Supplier Part Number 1: P17.8KLCT-ND
TP18 TP19 = TEST_POINT
U5 = CBTL02043A: Multiplexer And Demux/Decoder, CBT/FST/QS/5C/B Series, 1-Func, 2 Line Input, 1 Line Output, True Output, PQCC20; Manufacturer 1: NXP Semiconductors; Supplier 1: Digi-Key; RoHS: Yes; Category: Interface ICs; Stock 1: 19938; Pricing 1: 1=1,77000, 10=1,63000 (USD); ComponentLink1URL: https://datasheet.ciiva.com:443/pdfs/VipMasterIC/IC/PHGL/PHGL-S-A0000727649/PHGL-S-A0000727649-1.pdf?src-supplier=IHS+Markit; ComponentLink1Description: https://datasheet.ciiva.com:443/pdfs/VipMasterIC/IC/PHGL/PHGL-S-A0000727649/PHGL-S-A0000727649-1.pdf?src-supplier=IHS+Markit; ComponentLink2URL: https://datasheet.ciiva.com/4921/cbtl02043a-cbtl02043b-87520-4921245.pdf?src-supplier=Mouser; ComponentLink2Description: https://datasheet.ciiva.com/4921/cbtl02043a-cbtl02043b-87520-4921245.pdf?src-supplier=Mouser; ComponentLink3URL: https://datasheet.ciiva.com/6637/cbtl02043a-cbtl02043b-6637066.pdf?src-supplier=Digi-Key; ComponentLink3Description: https://datasheet.ciiva.com/6637/cbtl02043a-cbtl02043b-6637066.pdf?src-supplier=Digi-Key; Supplier Part Number 1: 568-6678-1-ND
U6 = PTN5150A: Power Supply Support Circuit, Fixed, 2 Channel, 0.2, PQCC12; Manufacturer 1: NXP Semiconductors; Supplier 1: Digi-Key; RoHS: Yes; Category: Integrated Circuits (ICs); Stock 1: 2334; Pricing 1: 1=1,07000, 10=0,95400, 25=0,90560, 100=0,87780 (USD); ComponentLink1URL: https://www.nxp.com/docs/en/data-sheet/PTN5150.pdf?src-supplier=Digi-Key; ComponentLink1Description: https://www.nxp.com/docs/en/data-sheet/PTN5150.pdf?src-supplier=Digi-Key; ComponentLink2URL: http://www.farnell.com/datasheets/2615733.pdf?src-supplier=Newark; ComponentLink2Description: http://www.farnell.com/datasheets/2615733.pdf?src-supplier=Newark; Supplier Part Number 1: 568-13084-1-ND

## Sheet Project_Information.SchDoc: =project_title
size Tabloid; CompanyName: Luxonis Holding; DrawnBy: David Malovrh; Organization: Luxonis Holding; Address1: 1925 Harmony Park Drive; Address2: Westminster, CO; Address3: 80234; Address4: United States; DocumentNumber: D0001093; Revision: R1M1E1; SheetNumber: 1; SheetTotal: 9
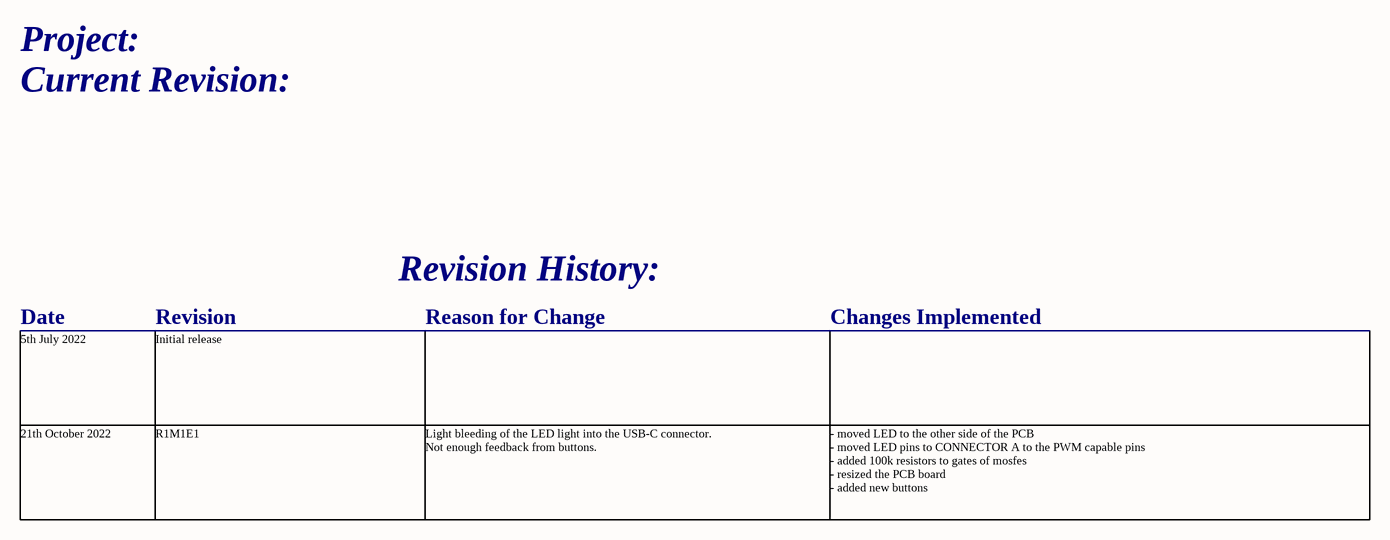
[diagram p8: Project_Information.SchDoc]

### Notes on the sheet
- Project:
- Current Revision:
- Revision History:
- Date
- Revision
- Reason for Change
- Changes Implemented
- 5th July 2022
- Initial release
- 21th October 2022
- R1M1E1
- Light bleeding of the LED light into the USB-C connector.
  Not enough feedback from buttons.
- - moved LED to the other side of the PCB
  - moved LED pins to CONNECTOR A to the PWM capable pins
  - added 100k resistors to gates of mosfes
  - resized the PCB board
  - added new buttons
- Title
- Size:
- Date:
- Tabloid
- Number:
- Time:
- Revision:
- Sheet
- of
- Drawn by:

## Sheet DM2080_EEPROM.SchDoc: =project_title
size Tabloid; PageSetup: Record=PageOptions|CenterHorizontal=True|CenterVertical=True|PrintScale=0.73|XCorrection=1.00|YCorrection=1.00|PrintKind=0|BorderSize=5000000|LeftOffset=0|BottomOffset=0|Orientation=2|PaperLength=1000|PaperWidth=1000|Scale=100|PaperSource=7|PrintQuality=-4|MediaType=1|DitherType=10|PaperKind=A4|PrintScaleMode=1; CompanyName: Luxonis Holding; DrawnBy: David Malovrh; Organization: Luxonis Holding; Address1: 1925 Harmony Park Drive; Address2: Westminster, CO; Address3: 80234; Address4: United States; DocumentNumber: D0001093; Revision: R1M1E1; SheetNumber: 10; SheetTotal: 11
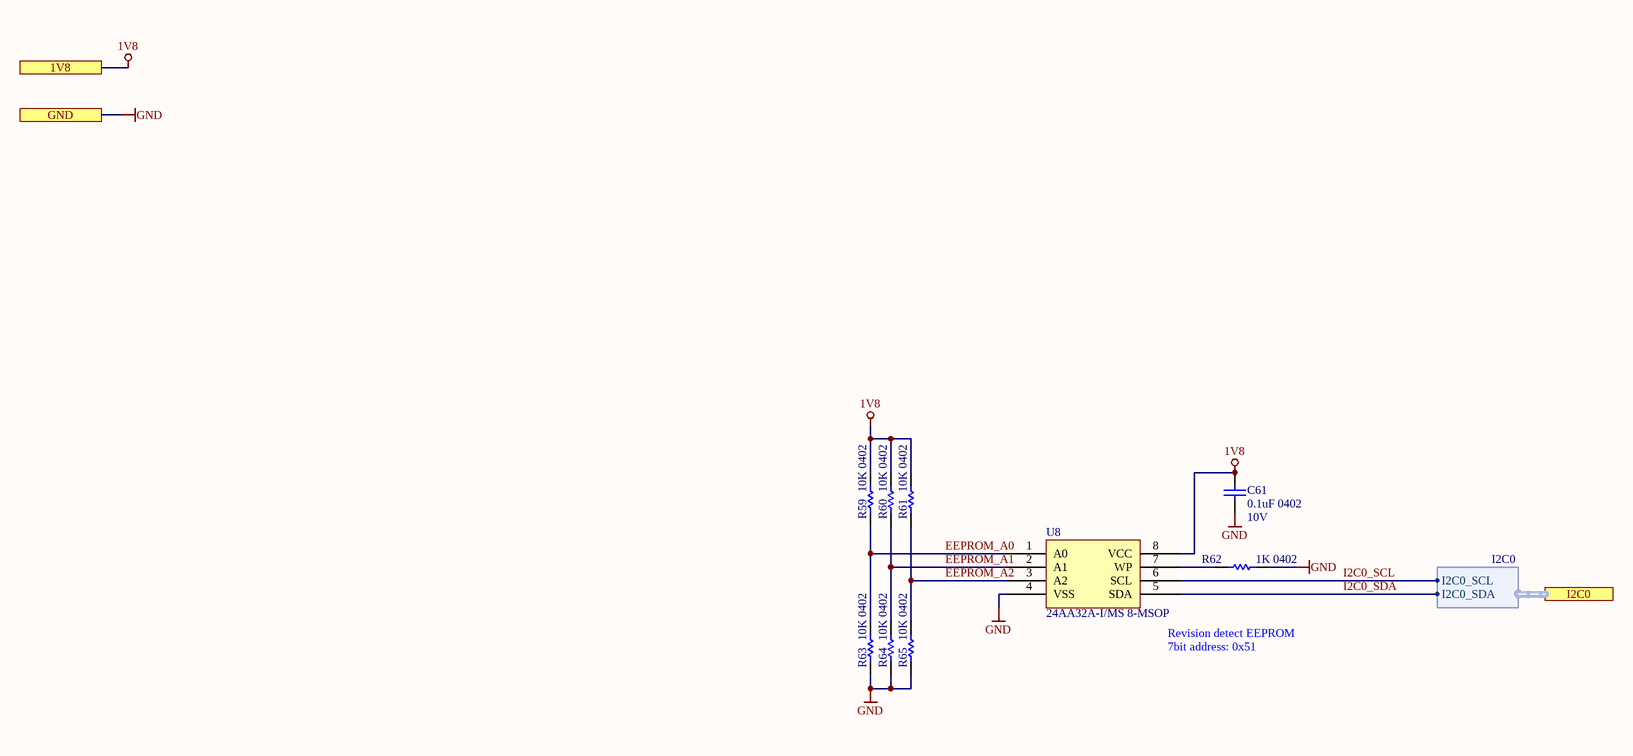
[diagram p9: DM2080_EEPROM.SchDoc]

### Parts
C61  0.1uF 0402  Voltage Rating: 10V  [CAPC0402(1005)70_L]
R59  10K 0402  [RESC0402(1005)_L]
R60  10K 0402  [RESC0402(1005)_L]
R61  10K 0402  [RESC0402(1005)_L]
R62  1K 0402  [RESC0402(1005)_L]
R63  10K 0402  [RESC0402(1005)_L]
R64  10K 0402  [RESC0402(1005)_L]
R65  10K 0402  [RESC0402(1005)_L]
U8  24AA32A-I/MS 8-MSOP  [24AA32A-I/MS]

### Ports
1V8, GND, I2C0 (harness I2C0)

### Harnesses
I2C0: I2C0_SCL, I2C0_SDA

### Nets
1V8: C61.2 R59.2 R60.2 R61.2 U8.8(VCC) ; port 1V8
GND: C61.1 R62.1 R63.1 R64.1 R65.1 U8.4(VSS) ; port GND
EEPROM_A0: R59.1 R63.2 U8.1(A0)
EEPROM_A1: R60.1 R64.2 U8.2(A1)
EEPROM_A2: R61.1 R65.2 U8.3(A2)
I2C0_SCL: U8.6(SCL) ; port I2C0.I2C0_SCL
I2C0_SDA: U8.5(SDA) ; port I2C0.I2C0_SDA
NetR62_2: R62.2 U8.7(WP)

### Notes on the sheet
- (near U8) Revision detect EEPROM
- (near U8) 7bit address: 0x51
- Title
- Size:
- Date:
- Tabloid
- Number:
- Time:
- Revision:
- Sheet
- of
- Drawn by:

### Library data of the parts
C61 = GRM155R71A104JA01D: CAP CER 0.1UF 10V X7R 0402 5%; Manufacturer 1: Murata; Capacitance: 100nF; Supplier 1: Digi-Key; Manufacturer Part Number 1: GRM155R71A104JA01D; Stock 1: 1346709; Pricing 1: 1=0.10000, 10=0.02500, 100=0.01130, 500=0.00806, 1000=0.00633, 2500=0.00575, 5000=0.00529 (USD); RoHS: Yes; Mount: Surface Mount; Case/Package: 0402; Case Code (Imperial): 0402; Case Code (Metric): 1005; Min Operating Temperature: -55°C; Max Operating Temperature: 125°C; Tolerance: 5%; Packaging: Tape and Reel; Voltage Rating (DC): 10V; Dielectric: X7R; Package Quantity: 10000; Termination: SMD/SMT; Length: 1mm; Height: 0.5mm; Width: 0.02inch; Thickness: 0.022inch; Depth: 0.5mm; Radiation Hardening: No; Lead Free: Lead Free; ComponentLink1URL: https://datasheet.ciiva.com/5411/product-5411135.pdf?src-supplier=Mouser; ComponentLink1Description: https://datasheet.ciiva.com/5411/product-5411135.pdf?src-supplier=Mouser; ComponentLink2URL: https://datasheet.ciiva.com/11618/c02e-11618821.pdf?src-supplier=Avnet; ComponentLink2Description: https://datasheet.ciiva.com/11618/c02e-11618821.pdf?src-supplier=Avnet; Supplier Part Number 1: 490-10777-1-ND
R59-R61 R63-R65 = RC0402FR-1310KL: RES SMD 10K OHM 1% 0402 1/16W Chip Resistor, 0402 [1005 Metric], 10 kohm, RC Series, 50 V, Thick Film, 62.5 mW; Manufacturer 1: Yageo; Resistance: 10kR; Temperature Coefficient: 100ppm/°C; Power Rating: 62.5mW; Voltage Rating: 50V; ComponentLink1URL: https://datasheet.ciiva.com/16940/pyu-rc0402-51-rohs-l-6-16940293.pdf?src-supplier=Avnet+Europe; ComponentLink1Description: https://datasheet.ciiva.com/16940/pyu-rc0402-51-rohs-l-6-16940293.pdf?src-supplier=Avnet+Europe; ComponentLink2URL: https://datasheet.ciiva.com/28386/pyu-rc0402-51-rohs-l-6-28386855.pdf?src-supplier=Avnet+Europe; ComponentLink2Description: https://datasheet.ciiva.com/28386/pyu-rc0402-51-rohs-l-6-28386855.pdf?src-supplier=Avnet+Europe; ComponentLink3URL: https://datasheet.ciiva.com/16740/pyu-rc0402-51-rohs-l-6-r-16740602.pdf?src-supplier=Future+Electronics; ComponentLink3Description: https://datasheet.ciiva.com/16740/pyu-rc0402-51-rohs-l-6-r-16740602.pdf?src-supplier=Future+Electronics; ComponentLink4URL: https://datasheet.ciiva.com/8891/pyu-rc0402-51-rohs-l-6-8891339.pdf?src-supplier=Avnet; ComponentLink4Description: https://datasheet.ciiva.com/8891/pyu-rc0402-51-rohs-l-6-8891339.pdf?src-supplier=Avnet; ComponentLink5URL: https://datasheet.ciiva.com/5557/pyu-rc0402-51-rohs-l-6-r-5557997.pdf?src-supplier=Mouser; ComponentLink5Description: https://datasheet.ciiva.com/5557/pyu-rc0402-51-rohs-l-6-r-5557997.pdf?src-supplier=Mouser; ComponentLink6URL: https://datasheet.ciiva.com/7983/1018594-7983533.pdf?src-supplier=Element14; ComponentLink6Description: https://datasheet.ciiva.com/7983/1018594-7983533.pdf?src-supplier=Element14; Supplier 1: Newark; Manufacturer Part Number 1: RC0402FR-1310KL; Stock 1: 62239; Pricing 1: 1=0.10000, 25=0.01200, 100=0.00400, 250=0.00400, 500=0.00300, 1000=0.00300 (USD); RoHS: Yes; Case/Package: 0402; Number of Pins: 2; Contact Plating: Tin,Matte,Lead; Case Code (Imperial): 0402; Case Code (Metric): 1005; Min Operating Temperature: -55°C; Max Operating Temperature: 155°C; Tolerance: 1%; Composition: Thick Film; Packaging: Tape and Reel; Termination: SMD/SMT; Military Standard: Not; Voltage Rating (DC): 50V; Working Voltage: 50V; Number of Terminations: 2; Length: 1mm; Depth: 0.5mm; Radiation Hardening: No; REACH SVHC: No SVHC; Lead Free: Lead Free; Supplier Part Number 1: 67R9960; Supplier 2: Future Electronics; Supplier 3: Mouser; Supplier 4: Element14; Supplier Part Number 2: RC0402FR-1310KL-CUTT; Supplier Part Number 3: 603-RC0402FR-1310KL; Supplier Part Number 4: 1799235
R62 = RC0402FR-071KL: RES SMD 1K OHM 1% 1/16W 0402; Manufacturer 1: Yageo; Temperature Coefficient: 100ppm/°C; Power Rating: 62.5mW; Voltage Rating (DC): 50V; Resistance: 1kR; RoHS: Yes; Number of Pins: 2; Case Code (Imperial): 0402; Case Code (Metric): 1005; Min Operating Temperature: -55°C; Max Operating Temperature: 155°C; Packaging: Tape and Reel; Composition: Thick Film; Voltage Rating: 50V; Military Standard: Not; Termination: SMD/SMT; Length: 1mm; Height: 0.32mm; Width: 0.5mm; Depth: 0.5mm; Lead Free: Lead Free; REACH SVHC: Unknown; ComponentLink1URL: https://datasheet.ciiva.com/11819/0900766b80c66297-11819477.pdf?src-supplier=RSComponents; ComponentLink1Description: https://datasheet.ciiva.com/11819/0900766b80c66297-11819477.pdf?src-supplier=RSComponents; ComponentLink2URL: https://datasheet.ciiva.com/12666/pyu-rc0402-51-rohs-l-6-r-12666741.pdf?src-supplier=Mouser; ComponentLink2Description: https://datasheet.ciiva.com/12666/pyu-rc0402-51-rohs-l-6-r-12666741.pdf?src-supplier=Mouser; ComponentLink3URL: https://datasheet.ciiva.com/17063/pyu-rc0402-51-rohs-l-6-r-17063193.pdf?src-supplier=Future+Electronics; ComponentLink3Description: https://datasheet.ciiva.com/17063/pyu-rc0402-51-rohs-l-6-r-17063193.pdf?src-supplier=Future+Electronics; ComponentLink4URL: https://datasheet.ciiva.com/22747/1018594-22747513.pdf?src-supplier=Element14; ComponentLink4Description: https://datasheet.ciiva.com/22747/1018594-22747513.pdf?src-supplier=Element14; ComponentLink5URL: https://datasheet.ciiva.com/7849/1018594-7849869.pdf?src-supplier=Element14; ComponentLink5Description: https://datasheet.ciiva.com/7849/1018594-7849869.pdf?src-supplier=Element14; ComponentLink6URL: https://datasheet.ciiva.com/7983/1018594-7983502.pdf?src-supplier=Element14; ComponentLink6Description: https://datasheet.ciiva.com/7983/1018594-7983502.pdf?src-supplier=Element14; ComponentLink7URL: https://datasheet.ciiva.com/7849/1018594-7849871.pdf?src-supplier=Element14; ComponentLink7Description: https://datasheet.ciiva.com/7849/1018594-7849871.pdf?src-supplier=Element14; Supplier 1: Digi-Key; Manufacturer Part Number 1: RC0402FR-071KL; Stock 1: 60695854; Pricing 1: 1=0.10000, 10=0.01600, 100=0.00670, 1000=0.00301, 2500=0.00261, 5000=0.00215 (USD); Case/Package: 0402; Tolerance: 1%; Supplier Part Number 1: 311-1.00KLRCT-ND
U8 = 24AA32A-I/MS: IC EEPROM 32K I2C 400KHZ 8MSOP Memory IC 32Kb (4K x 8) I²C 400kHz 900ns 8-MSOP; Manufacturer 1: Microchip; Interface: I2C,Serial,2-Wire; Access Time: 3500ns; Max Supply Voltage: 5.5V; Min Supply Voltage: 1.7V; Nominal Supply Current: 3mA; Supplier 1: Digi-Key; Stock 1: 4213; Pricing 1: 1=0.39000, 25=0.38120, 100=0.36050 (USD); RoHS: Yes; Mount: Surface Mount; Case/Package: MSOP; Number of Pins: 8; Contact Plating: Tin,Matte; Min Operating Temperature: -40°C; Max Operating Temperature: 85°C; Max Frequency: 400kHz; Frequency: 400kHz; Packaging: Rail/Tube; Density: 32Kb; Memory Size: 32Kb; Package Quantity: 100; Length: 3mm; Height: 0.85mm; Width: 3mm; Radiation Hardening: No; Lead Free: Lead Free; REACH SVHC: No SVHC; ComponentLink1URL: https://datasheet.ciiva.com/16309/filehandler-aspxddocname-en011853-16309808.pdf?src-supplier=Future+Electronics; ComponentLink1Description: https://datasheet.ciiva.com/16309/filehandler-aspxddocname-en011853-16309808.pdf?src-supplier=Future+Electronics; ComponentLink2URL: https://datasheet.ciiva.com/16621/21713l-16621382.pdf?src-supplier=Avnet+Europe; ComponentLink2Description: https://datasheet.ciiva.com/16621/21713l-16621382.pdf?src-supplier=Avnet+Europe; ComponentLink3URL: https://datasheet.ciiva.com/3185/21713l-3185209.pdf?src-supplier=Avnet; ComponentLink3Description: https://datasheet.ciiva.com/3185/21713l-3185209.pdf?src-supplier=Avnet; ComponentLink4URL: https://datasheet.ciiva.com/1154/1688094-1154810.pdf?src-supplier=Element14; ComponentLink4Description: https://datasheet.ciiva.com/1154/1688094-1154810.pdf?src-supplier=Element14; ComponentLink5URL: https://datasheet.ciiva.com/41454/001085239-da-01-en-ic-eeprom-32kbit-24aa32a-i-ms-msop-8-mcp-41454934.pdf?src-supplier=Conrad; ComponentLink5Description: https://datasheet.ciiva.com/41454/001085239-da-01-en-ic-eeprom-32kbit-24aa32a-i-ms-msop-8-mcp-41454934.pdf?src-supplier=Conrad; Supplier Part Number 1: 24AA32A-I/MS-ND; Memory Type: EEPROM; Manufacturer Part Number 1: 24AA32A-I/MS; Supplier 2: Mouser; Supplier 3: Newark; Supplier Part Number 2: 579-24AA32A-I/MS; Supplier Part Number 3: 38AH9658